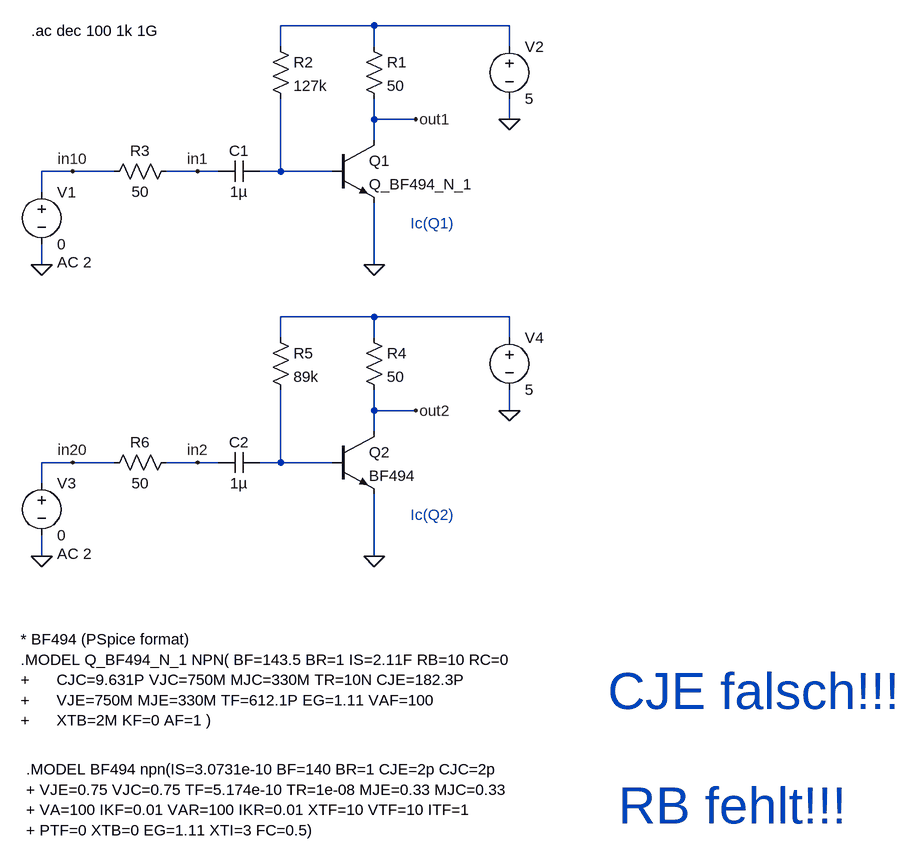
[diagram p0: schematic BF494_test.asc]
BF494_test.asc, the LTspice schematic file:
Version 4
SHEET 1 2856 1060
WIRE -208 -192 -352 -192
WIRE 0 -192 -208 -192
WIRE -352 -160 -352 -192
WIRE -208 -160 -208 -192
WIRE 0 -160 0 -192
WIRE -208 -48 -208 -80
WIRE -144 -48 -208 -48
WIRE 0 -48 0 -80
WIRE -208 -16 -208 -48
WIRE -672 32 -720 32
WIRE -608 32 -672 32
WIRE -480 32 -528 32
WIRE -448 32 -480 32
WIRE -352 32 -352 -80
WIRE -352 32 -384 32
WIRE -272 32 -352 32
WIRE -720 64 -720 32
WIRE -720 176 -720 144
WIRE -208 176 -208 80
WIRE -208 256 -352 256
WIRE 0 256 -208 256
WIRE -352 288 -352 256
WIRE -208 288 -208 256
WIRE 0 288 0 256
WIRE -208 400 -208 368
WIRE -144 400 -208 400
WIRE 0 400 0 368
WIRE -208 432 -208 400
WIRE -672 480 -720 480
WIRE -608 480 -672 480
WIRE -480 480 -528 480
WIRE -448 480 -480 480
WIRE -352 480 -352 368
WIRE -352 480 -384 480
WIRE -272 480 -352 480
WIRE -720 512 -720 480
WIRE -720 624 -720 592
WIRE -208 624 -208 528
FLAG -720 176 0
FLAG -480 32 in1
FLAG -672 32 in10
FLAG -208 176 0
FLAG -144 -48 out1
FLAG 0 -48 0
FLAG -720 624 0
FLAG -480 480 in2
FLAG -672 480 in20
FLAG -208 624 0
FLAG -144 400 out2
FLAG 0 400 0
DATAFLAG -112 160 "round(Ic(Q1)*100k)/100k"
DATAFLAG -112 608 "round(Ic(Q2)*100k)/100k"
SYMBOL npn -272 -16 R0
SYMATTR InstName Q1
SYMATTR Value Q_BF494_N_1
SYMBOL res -224 -176 R0
SYMATTR InstName R1
SYMATTR Value 50
SYMBOL res -368 -176 R0
SYMATTR InstName R2
SYMATTR Value 127k
SYMBOL cap -448 48 R270
WINDOW 0 32 32 VTop 2
WINDOW 3 0 32 VBottom 2
SYMATTR InstName C1
SYMATTR Value 1µ
SYMBOL voltage -720 48 R0
WINDOW 123 24 124 Left 2
WINDOW 39 0 0 Left 2
SYMATTR Value2 AC 2
SYMATTR InstName V1
SYMATTR Value 0
SYMBOL res -624 48 R270
WINDOW 0 32 56 VTop 2
WINDOW 3 0 56 VBottom 2
SYMATTR InstName R3
SYMATTR Value 50
SYMBOL voltage 0 -176 R0
SYMATTR InstName V2
SYMATTR Value 5
SYMBOL npn -272 432 R0
SYMATTR InstName Q2
SYMATTR Value BF494
SYMBOL res -224 272 R0
SYMATTR InstName R4
SYMATTR Value 50
SYMBOL res -368 272 R0
SYMATTR InstName R5
SYMATTR Value 89k
SYMBOL cap -448 496 R270
WINDOW 0 32 32 VTop 2
WINDOW 3 0 32 VBottom 2
SYMATTR InstName C2
SYMATTR Value 1µ
SYMBOL voltage -720 496 R0
WINDOW 123 24 124 Left 2
WINDOW 39 0 0 Left 2
SYMATTR Value2 AC 2
SYMATTR InstName V3
SYMATTR Value 0
SYMBOL res -624 496 R270
WINDOW 0 32 56 VTop 2
WINDOW 3 0 56 VBottom 2
SYMATTR InstName R6
SYMATTR Value 50
SYMBOL voltage 0 272 R0
SYMATTR InstName V4
SYMATTR Value 5
TEXT -752 752 Left 2 !* BF494 (PSpice format)\n.MODEL Q_BF494_N_1 NPN( BF=143.5 BR=1 IS=2.11F RB=10 RC=0 \n+      CJC=9.631P VJC=750M MJC=330M TR=10N CJE=182.3P \n+      VJE=750M MJE=330M TF=612.1P EG=1.11 VAF=100 \n+      XTB=2M KF=0 AF=1 )
TEXT -736 -184 Left 2 !.ac dec 100 1k 1G
TEXT -152 112 Left 2 ;Ic(Q1)
TEXT -744 952 Left 2 !.MODEL BF494 npn(IS=3.0731e-10 BF=140 BR=1 CJE=2p CJC=2p \n+ VJE=0.75 VJC=0.75 TF=5.174e-10 TR=1e-08 MJE=0.33 MJC=0.33 \n+ VA=100 IKF=0.01 VAR=100 IKR=0.01 XTF=10 VTF=10 ITF=1 \n+ PTF=0 XTB=0 EG=1.11 XTI=3 FC=0.5)
TEXT -152 560 Left 2 ;Ic(Q2)
TEXT 152 832 Left 6 ;CJE falsch!!!
TEXT 168 1008 Left 6 ;RB fehlt!!!

The netlist it stands for:
* BF494_test.asc
Q1 out1 N002 0 0 Q_BF494_N_1
R1 N001 out1 50
R2 N001 N002 127k
C1 in1 N002 1µ
V1 in10 0 0 AC 2
R3 in10 in1 50
V2 N001 0 5
Q2 out2 N004 0 0 BF494
R4 N003 out2 50
R5 N003 N004 89k
C2 in2 N004 1µ
V3 in20 0 0 AC 2
R6 in20 in2 50
V4 N003 0 5
.model NPN NPN
.model PNP PNP
.lib standard.bjt
* BF494 (PSpice format)
.MODEL Q_BF494_N_1 NPN( BF=143.5 BR=1 IS=2.11F RB=10 RC=0
+      CJC=9.631P VJC=750M MJC=330M TR=10N CJE=182.3P
+      VJE=750M MJE=330M TF=612.1P EG=1.11 VAF=100
+      XTB=2M KF=0 AF=1 )
.ac dec 100 1k 1G
* Ic(Q1)
.MODEL BF494 npn(IS=3.0731e-10 BF=140 BR=1 CJE=2p CJC=2p
+ VJE=0.75 VJC=0.75 TF=5.174e-10 TR=1e-08 MJE=0.33 MJC=0.33
+ VA=100 IKF=0.01 VAR=100 IKR=0.01 XTF=10 VTF=10 ITF=1
+ PTF=0 XTB=0 EG=1.11 XTI=3 FC=0.5)
* Ic(Q2)
* CJE falsch!!!
* RB fehlt!!!
.backanno
.end